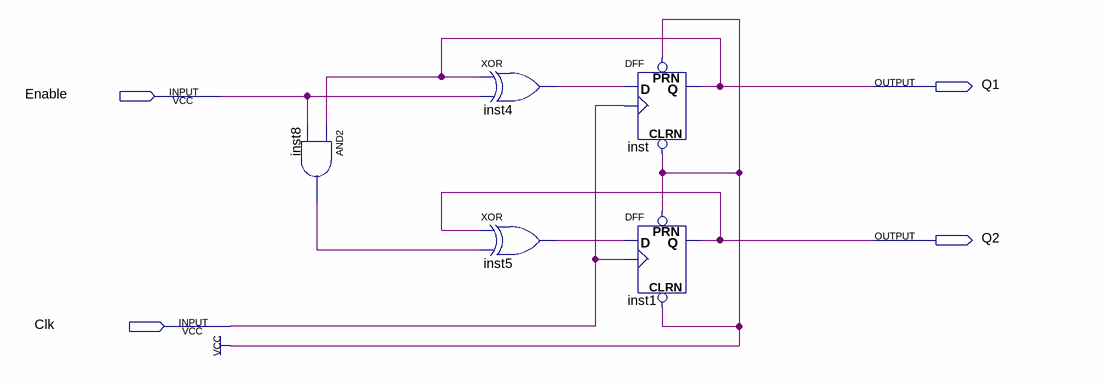
[diagram p0: schematic sheet]
// Quartus schematic up_counter.bdf as structural Verilog: 5 symbols, 4 pins
module up_counter (
  input  Enable,
  input  Clk,
  output Q1,
  output Q2
);

  wire inst4_out, inst5_out, inst8_out;

  and inst8 (inst8_out, Q1, Enable);
  xor inst4 (inst4_out, Q1, Enable);
  xor inst5 (inst5_out, Q2, inst8_out);
  DFF inst (.CLRN(1'b1), .CLK(Clk), .D(inst4_out), .PRN(1'b1), .Q(Q1));
  DFF inst1 (.CLRN(1'b1), .CLK(Clk), .D(inst5_out), .PRN(1'b1), .Q(Q2));
endmodule
